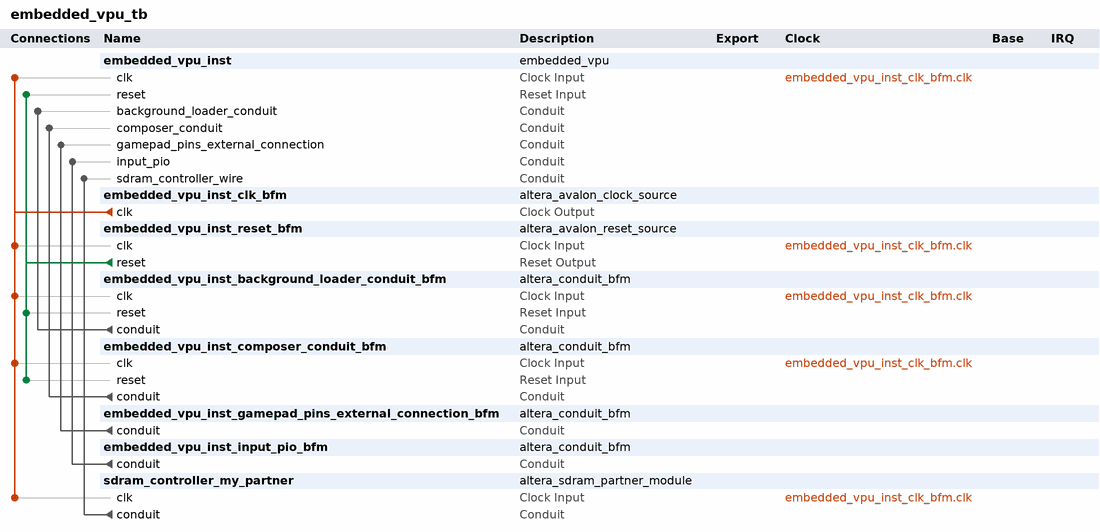
[diagram p0: system contents]
# Platform Designer (Qsys) system embedded_vpu_tb, Cyclone IV E EP4CE115F29C7
# Parameters at their usual value, and those the tool derives, are not listed.
package require -exact qsys 18.1
create_system embedded_vpu_tb
set_project_property DEVICE_FAMILY {Cyclone IV E}
set_project_property DEVICE EP4CE115F29C7

add_instance embedded_vpu_inst embedded_vpu 1.0

add_instance embedded_vpu_inst_clk_bfm altera_avalon_clock_source 18.1
set_instance_parameter_value embedded_vpu_inst_clk_bfm CLOCK_RATE 100000000

add_instance embedded_vpu_inst_reset_bfm altera_avalon_reset_source 18.1
set_instance_parameter_value embedded_vpu_inst_reset_bfm ASSERT_HIGH_RESET 0
set_instance_parameter_value embedded_vpu_inst_reset_bfm INITIAL_RESET_CYCLES 50

add_instance embedded_vpu_inst_background_loader_conduit_bfm altera_conduit_bfm 18.1
set_instance_parameter_value embedded_vpu_inst_background_loader_conduit_bfm CLOCKED_SIGNAL true
set_instance_parameter_value embedded_vpu_inst_background_loader_conduit_bfm ENABLE_RESET true
set_instance_parameter_value embedded_vpu_inst_background_loader_conduit_bfm SIGNAL_DIRECTIONS output
set_instance_parameter_value embedded_vpu_inst_background_loader_conduit_bfm SIGNAL_ROLES pll_locked
set_instance_parameter_value embedded_vpu_inst_background_loader_conduit_bfm SIGNAL_WIDTHS 1

add_instance embedded_vpu_inst_composer_conduit_bfm altera_conduit_bfm 18.1
set_instance_parameter_value embedded_vpu_inst_composer_conduit_bfm CLOCKED_SIGNAL true
set_instance_parameter_value embedded_vpu_inst_composer_conduit_bfm ENABLE_RESET true
set_instance_parameter_value embedded_vpu_inst_composer_conduit_bfm SIGNAL_DIRECTIONS input,input,output,input
set_instance_parameter_value embedded_vpu_inst_composer_conduit_bfm SIGNAL_ROLES new_frame_test,pixel_out,wrfull,wrreq
set_instance_parameter_value embedded_vpu_inst_composer_conduit_bfm SIGNAL_WIDTHS 1,24,1,1

add_instance embedded_vpu_inst_gamepad_pins_external_connection_bfm altera_conduit_bfm 18.1
set_instance_parameter_value embedded_vpu_inst_gamepad_pins_external_connection_bfm CLOCKED_SIGNAL false
set_instance_parameter_value embedded_vpu_inst_gamepad_pins_external_connection_bfm ENABLE_RESET false
set_instance_parameter_value embedded_vpu_inst_gamepad_pins_external_connection_bfm SIGNAL_DIRECTIONS output
set_instance_parameter_value embedded_vpu_inst_gamepad_pins_external_connection_bfm SIGNAL_WIDTHS 12

add_instance embedded_vpu_inst_input_pio_bfm altera_conduit_bfm 18.1
set_instance_parameter_value embedded_vpu_inst_input_pio_bfm CLOCKED_SIGNAL false
set_instance_parameter_value embedded_vpu_inst_input_pio_bfm ENABLE_RESET false
set_instance_parameter_value embedded_vpu_inst_input_pio_bfm SIGNAL_DIRECTIONS output
set_instance_parameter_value embedded_vpu_inst_input_pio_bfm SIGNAL_WIDTHS 1

add_instance sdram_controller_my_partner altera_sdram_partner_module 11.0
set_instance_parameter_value sdram_controller_my_partner CAS_LATENCY 2
set_instance_parameter_value sdram_controller_my_partner CONTR_NAME embedded_vpu_sdram_controller
set_instance_parameter_value sdram_controller_my_partner SDRAM_COL_WIDTH 10
set_instance_parameter_value sdram_controller_my_partner SDRAM_DATA_WIDTH 32
set_instance_parameter_value sdram_controller_my_partner SDRAM_ROW_WIDTH 13

# connections
add_connection embedded_vpu_inst_clk_bfm.clk embedded_vpu_inst.clk clock
add_connection embedded_vpu_inst_clk_bfm.clk embedded_vpu_inst_background_loader_conduit_bfm.clk clock
add_connection embedded_vpu_inst_clk_bfm.clk embedded_vpu_inst_composer_conduit_bfm.clk clock
add_connection embedded_vpu_inst_clk_bfm.clk embedded_vpu_inst_reset_bfm.clk clock
add_connection embedded_vpu_inst_clk_bfm.clk sdram_controller_my_partner.clk clock
add_connection embedded_vpu_inst_reset_bfm.reset embedded_vpu_inst.reset reset
add_connection embedded_vpu_inst_reset_bfm.reset embedded_vpu_inst_background_loader_conduit_bfm.reset reset
add_connection embedded_vpu_inst_reset_bfm.reset embedded_vpu_inst_composer_conduit_bfm.reset reset
add_connection embedded_vpu_inst_background_loader_conduit_bfm.conduit embedded_vpu_inst.background_loader_conduit conduit
add_connection embedded_vpu_inst_composer_conduit_bfm.conduit embedded_vpu_inst.composer_conduit conduit
add_connection embedded_vpu_inst_gamepad_pins_external_connection_bfm.conduit embedded_vpu_inst.gamepad_pins_external_connection conduit
add_connection embedded_vpu_inst_input_pio_bfm.conduit embedded_vpu_inst.input_pio conduit
add_connection sdram_controller_my_partner.conduit embedded_vpu_inst.sdram_controller_wire conduit

set_interconnect_requirement {$system} qsys_mm.clockCrossingAdapter HANDSHAKE
set_interconnect_requirement {$system} qsys_mm.enableEccProtection FALSE
set_interconnect_requirement {$system} qsys_mm.insertDefaultSlave FALSE
set_interconnect_requirement {$system} qsys_mm.maxAdditionalLatency 1

save_system embedded_vpu_tb.qsys
